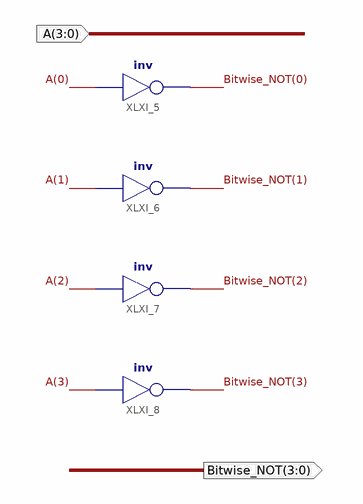
[diagram p0: schematic sheet 1]
// Xilinx ISE schematic Bitwise_NOT.sch (artix7) as structural Verilog: 4 symbols, 2 ports
module Bitwise_NOT (
  input  [3:0] A,
  output [3:0] Bitwise_NOT
);

  not XLXI_5 (Bitwise_NOT[0], A[0]);
  not XLXI_6 (Bitwise_NOT[1], A[1]);
  not XLXI_7 (Bitwise_NOT[2], A[2]);
  not XLXI_8 (Bitwise_NOT[3], A[3]);
endmodule
